# Altium schematic sheet Lora_Node_SCH.SchDoc
size A4; Organization: Altium Limited; Address1: L3, 12a Rodborough Rd; Address2: Frenchs Forest; Address3: NSW; Address4: Australia 2086; SheetNumber: 1; SheetTotal: 1; Vak: PCB design
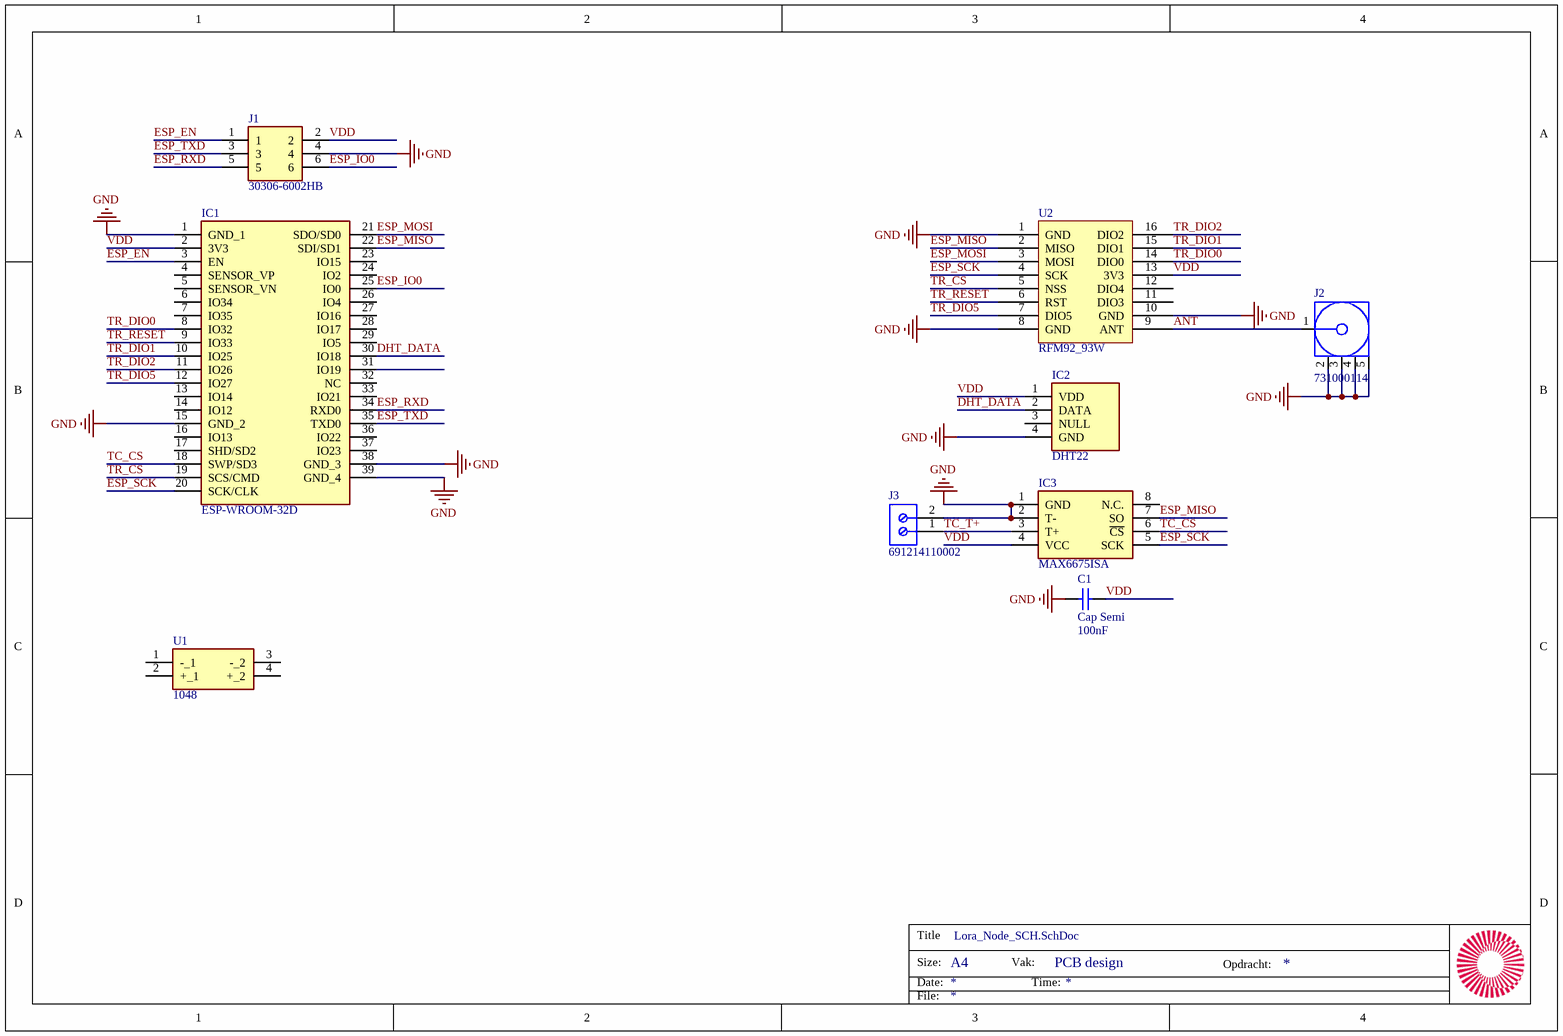
[diagram p0: Lora_Node_SCH.SchDoc]

## Parts
C1  Cap Semi  value 100nF  [C1206]
IC1  ESP-WROOM-32D  [ESPWROOM32D]
IC2  DHT22  [DHT22]
IC3  MAX6675ISA  [SOIC127P600X175-8N]
J1  30306-6002HB  [303066002HB]
J2  731000114  [MOLX-731000114_V]
J3  691214110002  [691214110002]
U1  1048  [1048]
U2  RFM92_93W  [RFM92_93W]

## Nets
GND: C1.1 IC1.1(GND_1) IC1.15(GND_2) IC1.38(GND_3) IC1.39(GND_4) IC2.4(GND) IC3.1(GND) IC3.2(T-) J1.4 J2.2 J2.3 J2.4 J2.5 J3.2 U2.1(GND) U2.8(GND) U2.10(GND)
ANT: J2.1 U2.9(ANT)
DHT_DATA: IC1.30(IO18) IC2.2(DATA)
ESP_EN: IC1.3(EN) J1.1
ESP_IO0: IC1.25(IO0) J1.6
ESP_MISO: IC1.22(SDI/SD1) IC3.7(SO) U2.2(MISO)
ESP_MOSI: IC1.21(SDO/SD0) U2.3(MOSI)
ESP_RXD: IC1.34(RXD0) J1.5
ESP_SCK: IC1.20(SCK/CLK) IC3.5(SCK) U2.4(SCK)
ESP_TXD: IC1.35(TXD0) J1.3
TC_CS: IC1.18(SWP/SD3) IC3.6(~{CS})
TC_T+: IC3.3(T+) J3.1
TR_CS: IC1.19(SCS/CMD) U2.5(NSS)
TR_DIO0: IC1.8(IO32) U2.14(DIO0)
TR_DIO1: IC1.10(IO25) U2.15(DIO1)
TR_DIO2: IC1.11(IO26) U2.16(DIO2)
TR_DIO5: IC1.12(IO27) U2.7(DIO5)
TR_RESET: IC1.9(IO33) U2.6(RST)
VDD: C1.2 IC1.2(3V3) IC2.1(VDD) IC3.4(VCC) J1.2 U2.13(3V3)

Not connected (* = marked no-connect by the designer): IC1 4(SENSOR_VP) 5(SENSOR_VN) 6(IO34) 7(IO35) 13(IO14) 14(IO12) 16(IO13) 17(SHD/SD2) 23(IO15) 24(IO2) 26(IO4) 27(IO16) 28(IO17) 29(IO5) 31(IO19) 32(NC) 33(IO21) 36(IO22) 37(IO23); IC2 3(NULL); IC3 8(N.C.); U1 1(-_1) 2(+_1) 3(-_2) 4(+_2); U2 11(DIO3) 12(DIO4)

## Notes on the sheet
- Title
- Size:
- Date:
- A4
- Vak:
- Time:
- Opdracht:
- File:

## Library data of the parts
C1 = Cap Semi: Capacitor (Semiconductor SIM Model); Published: 8-Jun-2000; LatestRevisionDate: 29-May-2009; LatestRevisionNote: IPC-7351 Footprint Added.; PackageReference: C1206; Publisher: Altium Limited; PackageDescription: Chip Capacitor
IC1 = ESP-WROOM-32D: Integrated Circuit; Manufacturer_Name: Espressif Systems; Datasheet Link: https://componentsearchengine.com/Datasheets/1/ESP-WROOM-32D.pdf; Height: 3.2mm; Manufacturer_Part_Number: ESP-WROOM-32D; Mouser Part Number: 356-ESP-WROOM-32D; Mouser Price/Stock: https://www.mouser.co.uk/ProductDetail/Espressif-Systems/ESP-WROOM-32D?qs=MLItCLRbWsyWVKgdQMcFuQ%3D%3D
IC2 = DHT22: Integrated Circuit; Manufacturer_Name: Aosong Electronics; Datasheet Link: https://datasheet4u.com/datasheet-parts/DHT22-datasheet.php?id=792211; Height: 25.1mm; Manufacturer_Part_Number: DHT22
IC3 = MAX6675ISA: Integrated Circuit; Manufacturer_Name: Maxim Integrated; Datasheet Link: http://datasheets.maximintegrated.com/en/ds/MAX6675.pdf; Height: 1.75mm; Manufacturer_Part_Number: MAX6675ISA; Mouser Part Number: N/A; Mouser Price/Stock: https://www.mouser.com/Search/Refine.aspx?Keyword=N%2FA
J1 = 30306-6002HB: Connector; Manufacturer_Name: 3M; Datasheet Link: https://componentsearchengine.com/Datasheets/2/30306-6002HB.pdf; Height: 9.4mm; Manufacturer_Part_Number: 30306-6002HB; Mouser Part Number: 517-30306-6002HB; Mouser Price/Stock: https://www.mouser.co.uk/ProductDetail/3M-Electronic-Solutions-Division/30306-6002HB?qs=Z%252B4xWyzEAtfSA90BvXHoAA%3D%3D; Arrow Part Number: 30306-6002HB; Arrow Price/Stock: https://www.arrow.com/en/products/30306-6002hb/3m?region=nac
J2 = CMP-2000-05487-1: SMA Right-Angle PCB Jack Receptacle, Brass Body, Gold Plated, 50 Ohm, 5-Pin THD, RoHS, Tray; Manufacturer: Molex; Datasheet Version: 09/2016; Package Description: 5-Pin Through Hole Device, Body 14.8 x 6.35 mm, Pitch 2.54 mm; Datasheet URL: http://www.molex.com/webdocs/datasheets/pdf/en-us/0731000114_RF_COAX_CONNECTORS.pdf; Manufacturer URL: http://www.molex.com/; Package Reference: 731000114; Mounting Technology: ThroughHole; Package URL: http://www.molex.com/pdm_docs/sd/731000114_sd.pdf
J3 = CMP-1502-02464-1: Serie 2141 - 3.50 mm Horizontal Entry Modular with Rising Cage Clamp WR-TBL, 2 pin; Manufacturer: Wurth Elektronik; Pin Number: 2; Pitch: 3.50mm; Datasheet URL: http://katalog.we-online.de/em/datasheet/6912141100xx.pdf; Packaging: Box; Mounting Technology: THT; Package Reference: 691214110002; Manufacturer URL: http://www.we-online.de; Part Number: 691214110002; Publisher: WurthElektronik; Operating Temperature: -40to105degC
U1 = 1048: Undefined or Miscellaneous; Manufacturer_Name: Keystone Electronics; Datasheet Link: http://www.keyelco.com/product-pdf.cfm?p=920; Manufacturer_Part_Number: 1048; Mouser Part Number: 534-1048; Mouser Price/Stock: https://www.mouser.co.uk/ProductDetail/Keystone-Electronics/1048?qs=%2F7TOpeL5Mz5jXkg8vI8Dyw%3D%3D